# Altium schematic sheet Main.SchDoc
size A2; SheetNumber: 1; SheetTotal: 1
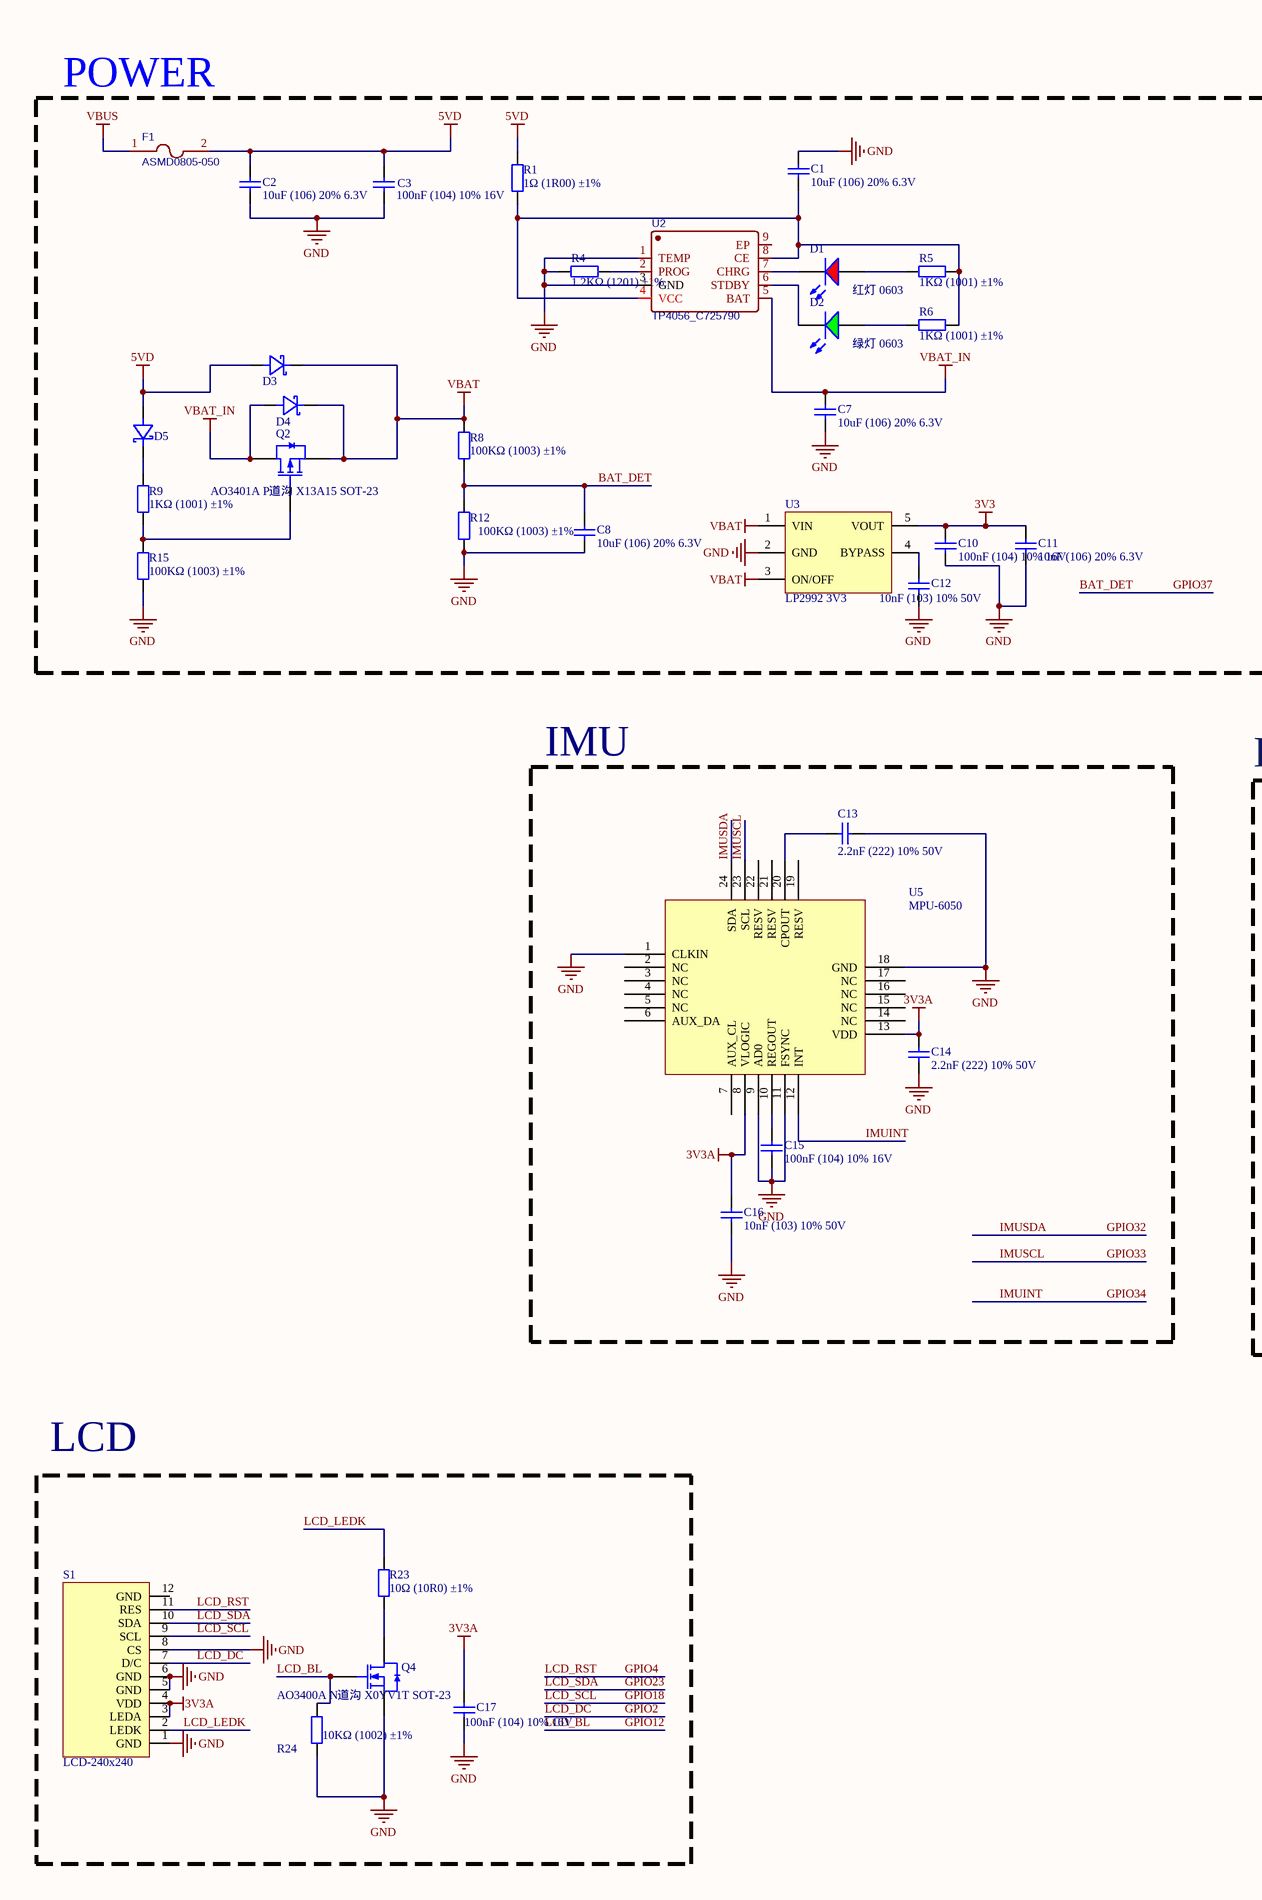
[diagram p0: Main.SchDoc, left]
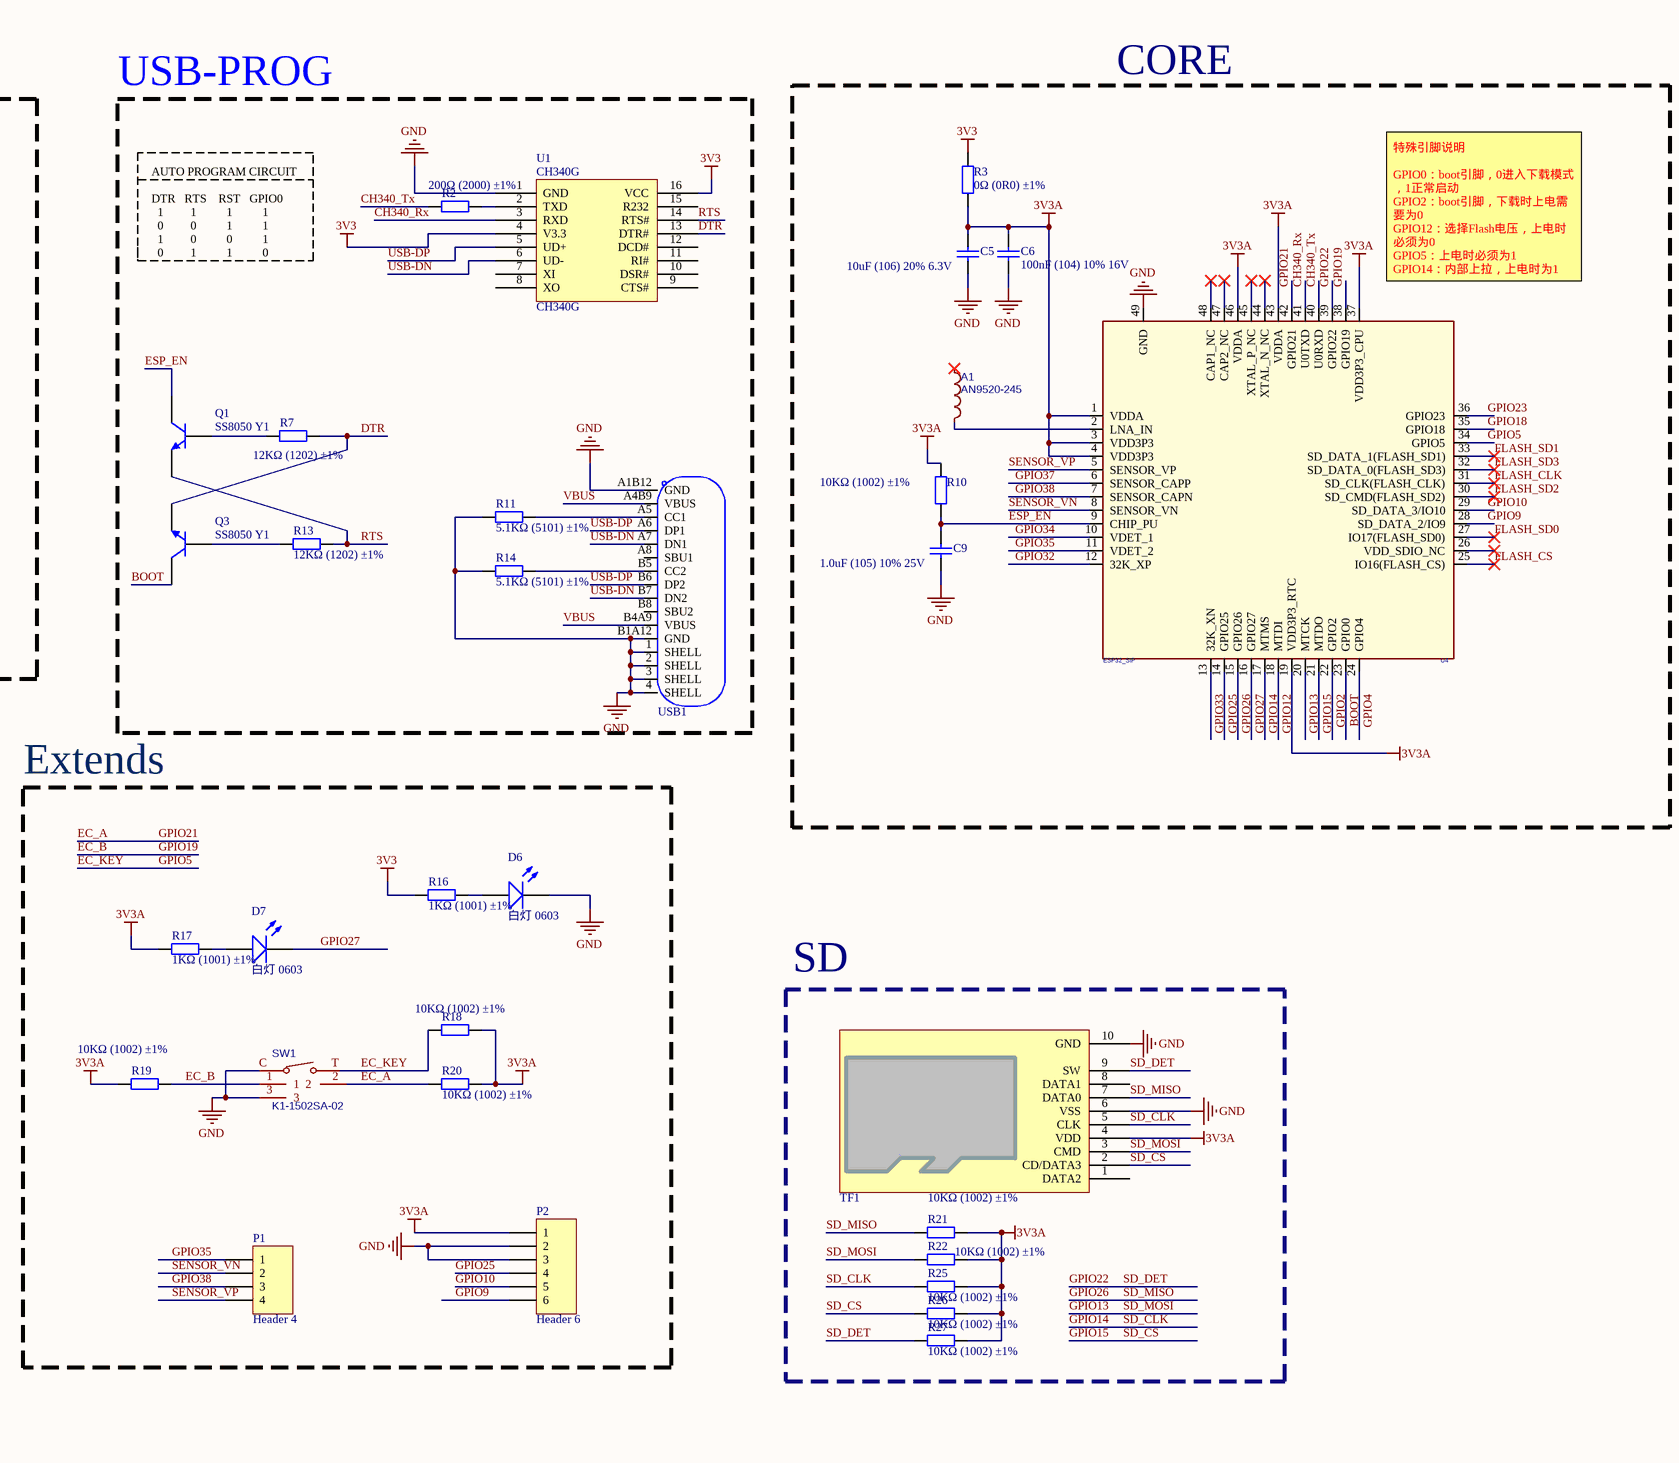
[diagram p1: Main.SchDoc, right]

## Parts
A1  AN9520-245  [ANT-SMD_L9.5-W2.1]
C1  10uF (106) 20% 6.3V  [0402_C]
C2  10uF (106) 20% 6.3V  [0402_C]
C3  100nF (104) 10% 16V  [0402_C]
C5  10uF (106) 20% 6.3V  [0402_C]
C6  100nF (104) 10% 16V  [0402_C]
C7  10uF (106) 20% 6.3V  [0402_C]
C8  10uF (106) 20% 6.3V  [0402_C]
C9  1.0uF (105) 10% 25V  [0402_C]
C10  100nF (104) 10% 16V  [0402_C]
C11  10uF (106) 20% 6.3V  [0402_C]
C12  10nF (103) 10% 50V  [0402_C]
C13  2.2nF (222) 10% 50V  [0402_C]
C14  2.2nF (222) 10% 50V  [0402_C]
C15  100nF (104) 10% 16V  [0402_C]
C16  10nF (103) 10% 50V  [0402_C]
C17  100nF (104) 10% 16V  [0402_C]
D1  红灯 0603  [0603_LED_S1]
D2  绿灯 0603  [0603_LED_S1]
D3  1N5819W  [SOD-123]  (value not drawn)
D4  1N5819W  [SOD-123]  (value not drawn)
D5  1N5819W  [SOD-123]  (value not drawn)
D6  白灯 0603  [0603_LED_S1]
D7  白灯 0603  [0603_LED_S1]
F1  ASMD0805-050  [ASMD0805]
P1  Header 4  [HDR1X4]
P2  Header 6  [HDR1X6]
Q1  SS8050 Y1  [SOT-23(SOT-23-3)]
Q2  AO3401A P道沟 X13A15 SOT-23  [SOT-23-3L]
Q3  SS8050 Y1  [SOT-23(SOT-23-3)]
Q4  AO3400A N道沟 X0YV1T SOT-23  [SOT-23-3L]
R1  1Ω (1R00) ±1%  [0402_R]
R2  200Ω (2000) ±1%  [0402_R]
R3  0Ω (0R0) ±1%  [0402_R]
R4  1.2KΩ (1201) ±1%  [0402_R]
R5  1KΩ (1001) ±1%  [0402_R]
R6  1KΩ (1001) ±1%  [0402_R]
R7  12KΩ (1202) ±1%  [0402_R]
R8  100KΩ (1003) ±1%  [0402_R]
R9  1KΩ (1001) ±1%  [0402_R]
R10  10KΩ (1002) ±1%  [0402_R]
R11  5.1KΩ (5101) ±1%  [0402_R]
R12  100KΩ (1003) ±1%  [0402_R]
R13  12KΩ (1202) ±1%  [0402_R]
R14  5.1KΩ (5101) ±1%  [0402_R]
R15  100KΩ (1003) ±1%  [0402_R]
R16  1KΩ (1001) ±1%  [0402_R]
R17  1KΩ (1001) ±1%  [0402_R]
R18  10KΩ (1002) ±1%  [0402_R]
R19  10KΩ (1002) ±1%  [0402_R]
R20  10KΩ (1002) ±1%  [0402_R]
R21  10KΩ (1002) ±1%  [0402_R]
R22  10KΩ (1002) ±1%  [0402_R]
R23  10Ω (10R0) ±1%  [0402_R]
R24  10KΩ (1002) ±1%  [0402_R]
R25  10KΩ (1002) ±1%  [0402_R]
R26  10KΩ (1002) ±1%  [0402_R]
R27  10KΩ (1002) ±1%  [0402_R]
S1  LCD-240x240  [LCD-240x240-FlUSH-154]
SW1  K1-1502SA-02  [KEY-SMD_K1-1502SA-02]
TF1  TF  [TF-SMD_THD2528]  (value not drawn)
U1  CH340G  [SOIC-16_150mil]
U2  TP4056_C725790  [ESOP-8_TP4056]
U3  LP2992 3V3  [SOT-23-5_L3.0-W1.7-P0.95-LS2.8-BL]
U4  ESP32_SIP  [QFN-48_7X7]
U5  MPU-6050  [QFN-24_4x4x05P]
USB1  TYPE-C16PIN  [TYPE-C-SMD]  (value not drawn)

## Blocks framed on the sheet
POWER: C1-C3 C7 C8 C10-C12 D1-D5 F1 Q2 R1 R4-R6 R8 R9 R12 R15 U2 U3
CORE: A1 C5 C6 C9 R3 R10 U4
IMU: C13-C16 U5
SD: R21 R22 R25-R27 TF1
LCD: C17 Q4 R23 R24 S1

## Nets
3V3: C10.2 C11.2 R3.2 R16.1 U1.4(V3.3) U1.16(VCC) U3.5(VOUT)
3V3A: C5.2 C6.2 C14.2 C16.2 C17.2 P2.1 R3.1 R10.2 R17.1 R18.2 R19.1 R20.2 R21.2 R22.2 R25.2 R26.2 R27.2 S1.3(LEDA) S1.4(VDD) TF1.4(VDD) U4.1(VDDA) U4.3(VDD3P3) U4.4(VDD3P3) U4.19(VDD3P3_RTC) U4.37(VDD3P3_CPU) U4.43(VDDA) U4.46(VDDA) U5.8(VLOGIC) U5.13(VDD)
5VD: C2.2 C3.2 D3.2(A) D5.2(A) F1.2 R1.1
GND: C1.2 C2.1 C3.1 C5.1 C6.1 C7.1 C8.1 C9.1 C10.1 C11.1 C12.1 C13.2 C14.1 C15.1 C16.1 C17.1 D6.K P2.2 P2.3 Q4.2(S) R4.1 R11.1 R12.1 R14.1 R15.1 R24.1 S1.1(GND) S1.5(GND) S1.6(GND) S1.8(CS) SW1.3 SW1.C TF1.6(VSS) TF1.10(GND) U1.1(GND) U2.1(TEMP) U2.3(GND) U3.2(GND) U4.49(GND) U5.1(CLKIN) U5.9(AD0) U5.11(FSYNC) U5.18(GND) USB1.1(SHELL) USB1.2(SHELL) USB1.3(SHELL) USB1.4(SHELL) USB1.A1B12(GND) USB1.B1A12(GND)
VBAT: D3.1(C) D4.1(C) Q2.2(S) R8.2 U3.1(VIN) U3.3(ON/OFF)
VBAT_IN: C7.2 D4.2(A) Q2.3(D) U2.5(BAT)
VBUS: F1.1 USB1.A4B9(VBUS) USB1.B4A9(VBUS)
BAT_DET: C8.2 R8.1 R12.2 U4.6(SENSOR_CAPP)  [also labelled GPIO37]
BOOT: Q3.3(C) U4.23(GPIO0)
CH340_Rx: U1.3(RXD) U4.41(U0TXD)
CH340_Tx: R2.1 U4.40(U0RXD)
DTR: Q3.2(E) R7.2 U1.13(DTR#)
EC_A: R20.1 SW1.2 U4.42(GPIO21)  [also labelled GPIO21]
EC_B: R19.2 SW1.1 U4.38(GPIO19)  [also labelled GPIO19]
EC_KEY: R18.1 SW1.T U4.34(GPIO5)  [also labelled GPIO5]
ESP_EN: C9.2 Q1.3(C) R10.1 U4.9(CHIP_PU)
FLASH_CLK: U4.31(SD_CLK(FLASH_CLK))
FLASH_CS: U4.25(IO16(FLASH_CS))
FLASH_SD0: U4.27(IO17(FLASH_SD0))
FLASH_SD1: U4.33(SD_DATA_1(FLASH_SD1))
FLASH_SD2: U4.30(SD_CMD(FLASH_SD2))
FLASH_SD3: U4.32(SD_DATA_0(FLASH_SD3))
GPIO2: S1.7(D/C) U4.22(GPIO2)  [also labelled LCD_DC]
GPIO4: S1.11(RES) U4.24(GPIO4)  [also labelled LCD_RST]
GPIO9: P2.6 U4.28(SD_DATA_2/IO9)
GPIO10: P2.5 U4.29(SD_DATA_3/IO10)
GPIO12: Q4.1(G) R24.2 U4.18(MTDI)  [also labelled LCD_BL]
GPIO13: R22.1 TF1.3(CMD) U4.20(MTCK)  [also labelled SD_MOSI]
GPIO14: R25.1 TF1.5(CLK) U4.17(MTMS)  [also labelled SD_CLK]
GPIO15: R26.1 TF1.2(CD/DATA3) U4.21(MTDO)  [also labelled SD_CS]
GPIO18: S1.9(SCL) U4.35(GPIO18)  [also labelled LCD_SCL]
GPIO22: R27.1 TF1.9(SW) U4.39(GPIO22)  [also labelled SD_DET]
GPIO23: S1.10(SDA) U4.36(GPIO23)  [also labelled LCD_SDA]
GPIO25: P2.4 U4.14(GPIO25)
GPIO26: R21.1 TF1.7(DATA0) U4.15(GPIO26)  [also labelled SD_MISO]
GPIO27: D7.K U4.16(GPIO27)
GPIO32: U4.12(32K_XP) U5.24(SDA)  [also labelled IMUSDA]
GPIO33: U4.13(32K_XN) U5.23(SCL)  [also labelled IMUSCL]
GPIO34: U4.10(VDET_1) U5.12(INT)  [also labelled IMUINT]
GPIO35: P1.1 U4.11(VDET_2)
GPIO38: P1.3 U4.7(SENSOR_CAPN)
LCD_LEDK: R23.2 S1.2(LEDK)
RTS: Q1.2(E) R13.2 U1.14(RTS#)
SENSOR_VN: P1.2 U4.8(SENSOR_VN)
SENSOR_VP: P1.4 U4.5(SENSOR_VP)
USB-DN: U1.6(UD-) USB1.A7(DN1) USB1.B7(DN2)
USB-DP: U1.5(UD+) USB1.A6(DP1) USB1.B6(DP2)
NetA1_2: A1.2 U4.2(LNA_IN)
NetC1_1: C1.1 R1.2 R5.2 R6.2 U2.4(VCC) U2.8(CE)
NetC12_2: C12.2 U3.4(BYPASS)
NetC13_1: C13.1 U5.20(CPOUT)
NetC15_2: C15.2 U5.10(REGOUT)
NetD1_A: D1.A R5.1
NetD1_K: D1.K U2.7(CHRG)
NetD2_A: D2.A R6.1
NetD2_K: D2.K U2.6(STDBY)
NetD5_1: D5.1(C) R9.2
NetD6_A: D6.A R16.2
NetD7_A: D7.A R17.2
NetQ1_1: Q1.1(B) R7.1
NetQ2_1: Q2.1(G) R9.1 R15.2
NetQ3_1: Q3.1(B) R13.1
NetQ4_3: Q4.3(D) R23.1
NetR2_2: R2.2 U1.2(TXD)
NetR4_2: R4.2 U2.2(PROG)
NetR11_2: R11.2 USB1.A5(CC1)
NetR14_2: R14.2 USB1.B5(CC2)

Not connected (* = marked no-connect by the designer): A1 1*; S1 12(GND); TF1 1(DATA2) 8(DATA1); U1 7(XI) 8(XO) 9(CTS#) 10(DSR#) 11(RI#) 12(DCD#) 15(R232); U2 9(EP); U4 26(VDD_SDIO_NC)* 44(XTAL_N_NC)* 45(XTAL_P_NC)* 47(CAP2_NC)* 48(CAP1_NC)*; U5 2(NC) 3(NC) 4(NC) 5(NC) 6(AUX_DA) 7(AUX_CL) 14(NC) 15(NC) 16(NC) 17(NC) 19(RESV) 21(RESV) 22(RESV); USB1 A8(SBU1) B8(SBU2)

## Notes on the sheet
- Text
- USB-PROG
- AUTO PROGRAM CIRCUIT
  DTR   RTS    RST   GPIO0
  1         1          1          1
  0         0          1          1
  1         0          0          1
  0         1          1          0
- (near U4) 特殊引脚说明
  GPIO0：boot引脚，0进入下载模式，1正常启动
  GPIO2：boot引脚，下载时上电需要为0
  GPIO12：选择Flash电压，上电时必须为0
  GPIO5：上电时必须为1
  GPIO14：内部上拉，上电时为1
  GPIO15：上电时必须为1
- Extends

## Library data of the parts
A1 = AN9520-245: 陶瓷wifi/bt天线; BOM_Manufacturer: Rainsun; BOM_Supplier: LCSC; BOM_Manufacturer Part: AN9520-245; BOM_Supplier Part: C99665; BOM_JLCPCB Part Class: Extended Part; spicePre: L; spiceSymbolName: AN9520-245
C1 C2 C5 C7 C8 C11 = 0402 10uF (106) 20% 6.3V: 贴片电容; ComponentLink1Description: 供应商链接; ComponentLink1URL: http://www.szlcsc.com/product/details_16204.html; Package: 0402; Supplier: LC; SuppliersPartNumber: C15525
C3 C6 C10 C15 C17 = 0402 100nF (104) 10% 16V: 贴片电容; ComponentLink1Description: 供应商链接; ComponentLink1URL: http://www.szlcsc.com/product/details_1877.html; Package: 0402; Supplier: LC; SuppliersPartNumber: C1525
C9 = 0402 1.0uF (105) 10% 25V: 贴片电容; ComponentLink1Description: 供应商链接; ComponentLink1URL: http://www.szlcsc.com/product/details_53938.html; Package: 0402; Supplier: LC; SuppliersPartNumber: C52923
C12 C16 = 0402 10nF (103) 10% 50V: 贴片电容; ComponentLink1Description: 供应商链接; ComponentLink1URL: http://www.szlcsc.com/product/details_15869.html; Package: 0402; Supplier: LC; SuppliersPartNumber: C15195
C13 C14 = 0402 2.2nF (222) 10% 50V: 贴片电容; ComponentLink1Description: 供应商链接; ComponentLink1URL: http://www.szlcsc.com/product/details_1883.html; Package: 0402; Supplier: LC; SuppliersPartNumber: C1531
D1 = 0603 红灯: 发光二极管; ComponentLink1Description: 供应商链接; ComponentLink1URL: http://www.szlcsc.com/product/details_2659.html; Package: 0603; Supplier: LC; SuppliersPartNumber: C2286
D2 = 0603 绿灯: 发光二极管; ComponentLink1Description: 供应商链接; ComponentLink1URL: http://www.szlcsc.com/product/details_73152.html; Package: 0603; Supplier: LC; SuppliersPartNumber: C72043
D3-D5 = 1N5819W: 二极管; Manufacturer: TWGMC(台湾迪嘉); Symbol: 1N5819W_C727115; Add into BOM: yes; Diode Configuration: 独立式; Reverse Voltage (Vr): 40V; Average Rectified Current (Io): 1A; Forward Voltage (Vf@If): 900mV@3A; Reverse Leakage Current (Ir): 1mA@40V; Device: 1N5819W_C727115; LCSC Part Name: 40V 1A 900mV@3A; Supplier Part: C727115; Manufacturer Part: 1N5819W; Supplier Footprint: SOD-123; JLCPCB Part Class: Extended Part; Datasheet: https://atta.szlcsc.com/upload/public/pdf/source/20200828/C727113_260B72EC53C389C21DF1E8AB243F1BFC.pdf; Supplier: LCSC; Convert to PCB: yes
D6 D7 = 0603 白灯: 发光二极管; ComponentLink1Description: 供应商链接; ComponentLink1URL: http://www.szlcsc.com/product/details_2663.html; Package: 0603; Supplier: LC; SuppliersPartNumber: C2290
F1 = ASMD0805-050: BOM_Manufacturer: JDTFUSE; Contributor: LCSC; BOM_Supplier: LCSC; BOM_Manufacturer Part: ASMD0805-050; BOM_Supplier Part: C135329; BOM_JLCPCB Part Class: Extended Part; spicePre: F; spiceSymbolName: ASMD0805-050
P1 = Header 4: Header, 4-Pin; LatestRevisionDate: 17-Jul-2002; LatestRevisionNote: Re-released for DXP Platform.; Publisher: Altium Limited
P2 = Header 6: Header, 6-Pin; LatestRevisionDate: 17-Jul-2002; LatestRevisionNote: Re-released for DXP Platform.; Publisher: Altium Limited
Q1 Q3 = SOT-23 SS8050 Y1: 三极管; ComponentLink1Description: 供应商链接; ComponentLink1URL: http://www.szlcsc.com/product/details_2507.html; Package: SOT-23; Supplier: LC; SuppliersPartNumber: C2150
Q2 = AO3401A P道沟 X13A15 SOT-23: MOS(场效应管); ComponentLink1Description: 供应商链接; ComponentLink1URL: http://www.szlcsc.com/product/details_15801.html; Package: SOT-23; Supplier: LC; SuppliersPartNumber: C15127
Q4 = AO3400A N道沟 X0YV1T SOT-23: MOS(场效应管); ComponentLink1Description: 供应商链接; ComponentLink1URL: http://www.szlcsc.com/product/details_21629.html; Package: SOT-23; Supplier: LC; SuppliersPartNumber: C20917
R1 = 0402 1Ω (1R00) 1%: 贴片电阻; ComponentLink1Description: 供应商链接; ComponentLink1URL: http://www.szlcsc.com/product/details_25829.html; Package: 0402; Supplier: LC; SuppliersPartNumber: C25086
R2 = 0402 200Ω (2000) 1%: 贴片电阻; ComponentLink1Description: 供应商链接; ComponentLink1URL: http://www.szlcsc.com/product/details_25830.html; Package: 0402; Supplier: LC; SuppliersPartNumber: C25087
R3 = 0402 0Ω (0R0) 1%: 贴片电阻; ComponentLink1Description: 供应商链接; ComponentLink1URL: http://www.szlcsc.com/product/details_17853.html; Package: 0402; Supplier: LC; SuppliersPartNumber: C17168
R4 = 0402 1.2KΩ (1201) 1%: 贴片电阻; ComponentLink1Description: 供应商链接; ComponentLink1URL: http://www.szlcsc.com/product/details_26605.html; Package: 0402; Supplier: LC; SuppliersPartNumber: C25862
R5 R6 R9 R16 R17 = 0402 1KΩ (1001) 1%: 贴片电阻; ComponentLink1Description: 供应商链接; ComponentLink1URL: http://www.szlcsc.com/product/details_12256.html; Package: 0402; Supplier: LC; SuppliersPartNumber: C11702
R7 R13 = 0402 12KΩ (1202) 1%: 贴片电阻; ComponentLink1Description: 供应商链接; ComponentLink1URL: http://www.szlcsc.com/product/details_26495.html; Package: 0402; Supplier: LC; SuppliersPartNumber: C25752
R8 R12 R15 = 0402 100KΩ (1003) 1%: 贴片电阻; ComponentLink1Description: 供应商链接; ComponentLink1URL: http://www.szlcsc.com/product/details_26484.html; Package: 0402; Supplier: LC; SuppliersPartNumber: C25741
R10 R18-R22 R24-R27 = 0402 10KΩ (1002) 1%: 贴片电阻; ComponentLink1Description: 供应商链接; ComponentLink1URL: http://www.szlcsc.com/product/details_26487.html; Package: 0402; Supplier: LC; SuppliersPartNumber: C25744
R11 R14 = 0402 5.1KΩ (5101) 1%: 贴片电阻; ComponentLink1Description: 供应商链接; ComponentLink1URL: http://www.szlcsc.com/product/details_26648.html; Package: 0402; Supplier: LC; SuppliersPartNumber: C25905
R23 = 0402 10Ω (10R0) 1%: 贴片电阻; ComponentLink1Description: 供应商链接; ComponentLink1URL: http://www.szlcsc.com/product/details_25820.html; Package: 0402; Supplier: LC; SuppliersPartNumber: C25077
S1 = LCD-240x240: 显示屏
SW1 = K1-1502SA-02: 拨码开关; BOM_Manufacturer: Rectangular Connectors - Contacts; Contributor: LCSC; BOM_Supplier: LCSC; BOM_Supplier Part: C128929; BOM_Manufacturer Part: K1-1502SA-02; BOM_JLCPCB Part Class: Extended Part; spicePre: S; spiceSymbolName: K1-1502SA-02
TF1 = TF卡座: 8脚自弹
U1 = CH340G_[C14267]: USB; ComponentLink1Description: 供应商链接; ComponentLink1URL: http://www.szlcsc.com/product/details_14927.html; Package: SOIC-16_150mil; Supplier: LC; SuppliersPartNumber: C14267
U2 = TP4056: BOM_Manufacturer: UMW(Youtai Semiconductor Co., Ltd.); Contributor: LCSC; BOM_Supplier: LCSC; BOM_Supplier Part: C725790; BOM_Manufacturer Part: TP4056; BOM_JLCPCB Part Class: Extended Part; spicePre: U; spiceSymbolName: TP4056_C725790
U3 = LP2992: LDO
U4 = ESP32-PICO
U5 = MPU-6050_[C24112]: 传感器; ComponentLink1Description: 供应商链接; ComponentLink1URL: http://www.szlcsc.com/product/details_24852.html; Package: QFN-24_4x4x05P; Supplier: LC; SuppliersPartNumber: C24112
USB1 = TYPE-C16PIN: Manufacturer: SHOU HAN(首韩); Add into BOM: yes; Connector Type: Type-C; Gender: 母座; Number of Contacts: 16; Number of Ports: 1; Current Rating - Power (Max): 3A; Symbol: TYPE-C16PIN; Device: TYPE-C16PIN; LCSC Part Name: Type-C 母座 卧贴 快充闪充 停产; Supplier Part: C393939; Manufacturer Part: TYPE-C16PIN; Supplier Footprint: SMD; JLCPCB Part Class: Extended Part; Datasheet: https://atta.szlcsc.com/upload/public/pdf/source/20190521/C393939_7B9043D4CF1026AF443AB60D91FBCD5C.pdf; Supplier: LCSC; Convert to PCB: yes; Standard: -; Mounting Style: 卧贴; Operating Temperature Range: -40~+85